# EAGLE design Main (EAGLE 7.2.0)
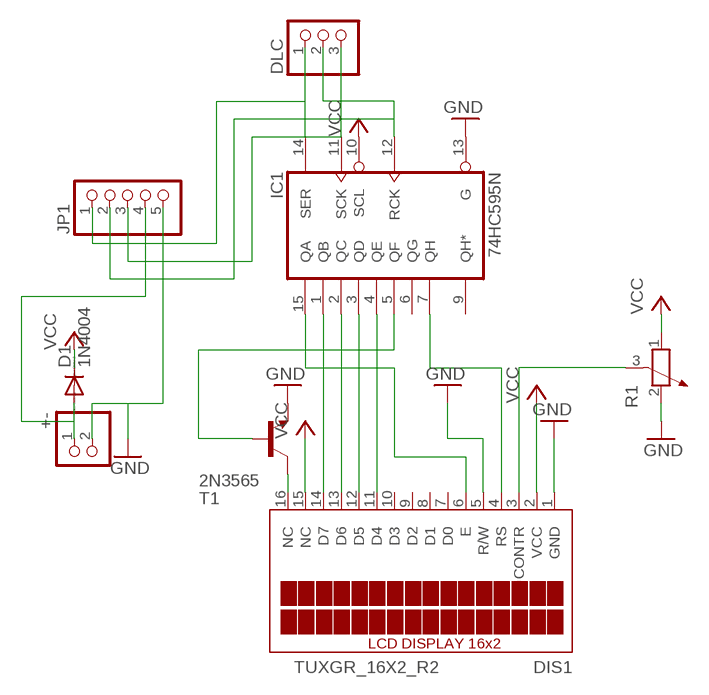
[diagram p0: schematic, sheet 1]

## Parts
+-  PINHD-1X2  [1X02]
D1  1N4004  [DO41-10]
DIS1  TUXGR_16X2_R2  [TUXGR_16X2_R2]
DLC  PINHD-1X3  [1X03]
IC1  74HC595N  [DIL16]
JP1  PINHD-1X5/90  [1X05/90]
R1  POTENTIOMETER_PT-10  [PT-10]
T1  2N3565  [TO92]

## Nets
GND: +-.2 DIS1.1(GND) DIS1.5(R/W) IC1.13(G) JP1.5 R1.2 T1.3(E)
N$1: DIS1.14(D7) IC1.1(QB)
N$2: DIS1.13(D6) IC1.2(QC)
N$3: DIS1.12(D5) IC1.3(QD)
N$4: DIS1.11(D4) IC1.4(QE)
N$5: +-.1 D1.A JP1.4
N$6: DIS1.16(NC) T1.1(C)
N$7: DIS1.6(E) IC1.15(QA)
N$8: DIS1.3(CONTR) R1.3
N$9: DIS1.4(RS) IC1.7(QH)
N$11: DLC.3 IC1.11(SCK) JP1.3
N$12: IC1.5(QF) T1.2(B)
N$13: DLC.1 IC1.14(SER) JP1.1
N$14: DLC.2 IC1.12(RCK) JP1.2
VCC: D1.C DIS1.2(VCC) DIS1.15(NC) IC1.10(SCL) R1.1
Unconnected: DIS1.7(D0) DIS1.8(D1) DIS1.9(D2) DIS1.10(D3) IC1.6(QG) IC1.9(QH*)

## Power pins joined to a net without a drawn wire
GND: IC1.8(GND)
VCC: IC1.16(VCC)

## Library data of the parts
+- = pinhead:PINHD-1X2: PIN HEADER
D1 = diode:1N4004: DIODE general purpose rectifier, 1 A
DIS1 = display-lcd:TUXGR_16X2_R2: Tuxgraphics LCD display 16x2 characters reflective, without background light Source: tuxgr_12x2_r2.pdf; OC_FARNELL: unknown; OC_NEWARK: unknown
DLC = pinhead:PINHD-1X3: PIN HEADER
IC1 = 74xx-eu:74*595: 8-bit SHIFT REGISTER, output latch
JP1 = pinhead:PINHD-1X5: PIN HEADER
R1 = rcl:POTENTIOMETER_: Potentiometer
T1 = transistor:2N3565: NPN TRANSISTOR

## Board
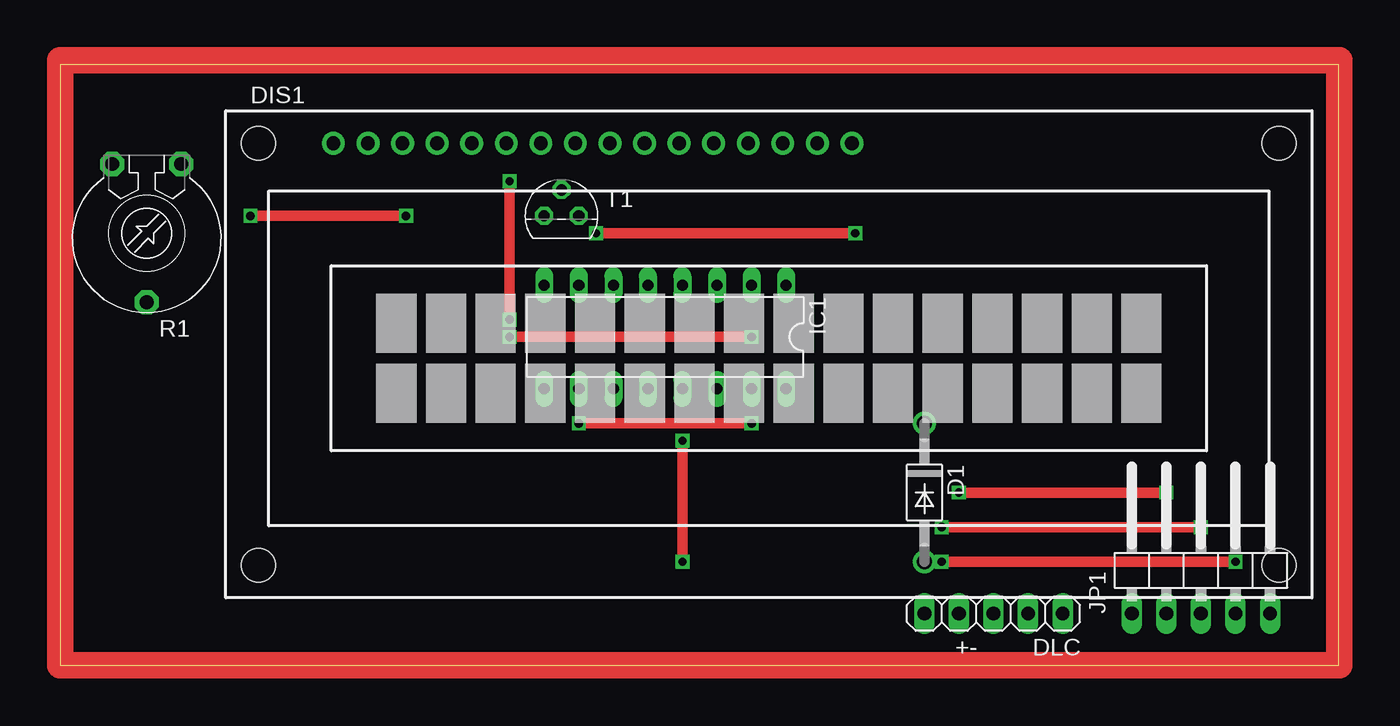
[diagram p1: board, top side]
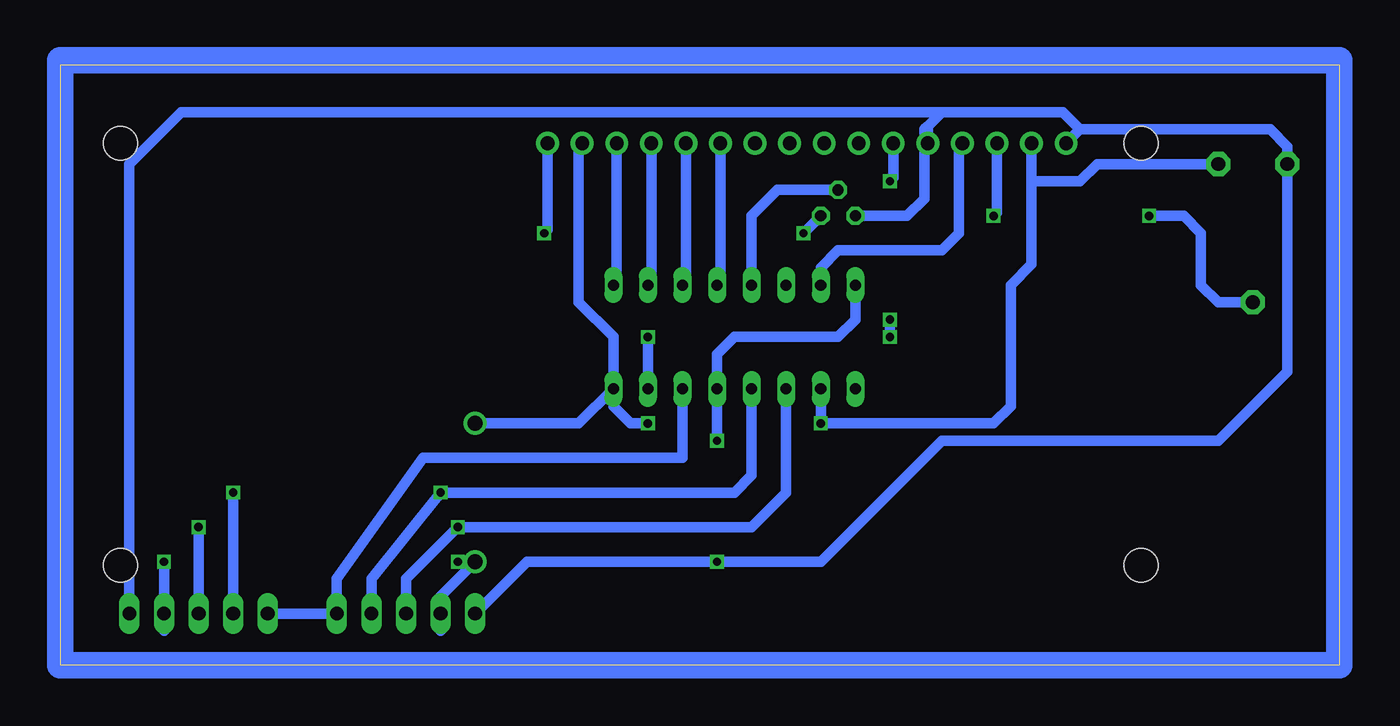
[diagram p2: board, bottom side, seen from below]

Size 93.96 x 44.12 mm. Coordinates in mm from the lower left corner, seen from the top.
Outline: 0,0 93.96,0 93.96,44.12 0,44.12 0,0
Copper layers (1*16): Top 0.035mm / dielectric 1.5mm / Bottom 0.035mm
Design rules "default *": minimum track width 30mil, minimum drill 24mil, track to track 8mil, track to pad 8mil, pad to pad 8mil, via to via 8mil, smd to smd 8mil, copper to edge 40mil, drill to drill 8mil, minimum pad ring 10mil, minimum via ring 8mil, stop-mask expansion 4mil, vias tented up to drill 0mil, thermal gap 10mil

### Footprints (pad centres in the part's own frame; a part is rotated, then mirrored left to right if it is on the bottom)
1X02 = drill 1.016 long: 1 -1.27,0; 2 1.27,0
DO41-10 = drill 1.118: A 5.08,0; C -5.08,0
TUXGR_16X2_R2 = drill 1 pad 1.676: 1 -32,15.5; 2 -29.46,15.5; 3 -26.92,15.5; 4 -24.38,15.5; 5 -21.84,15.5; 6 -19.3,15.5; 7 -16.76,15.5; 8 -14.22,15.5; 9 -11.68,15.5; 10 -9.14,15.5; 11 -6.6,15.5; 12 -4.06,15.5; 13 -1.52,15.5; 14 1.02,15.5; 15 3.56,15.5; 16 6.1,15.5 | hole 2.5: -37.5,-15.5; 37.5,-15.5; -37.5,15.5; 37.5,15.5
1X03 = drill 1.016 long: 1 -2.54,0; 2 0,0; 3 2.54,0
DIL16 = drill 0.813 long: 1 -8.89,-3.81; 2 -6.35,-3.81; 3 -3.81,-3.81; 4 -1.27,-3.81; 5 1.27,-3.81; 6 3.81,-3.81; 7 6.35,-3.81; 8 8.89,-3.81; 9 8.89,3.81; 10 6.35,3.81; 11 3.81,3.81; 12 1.27,3.81; 13 -1.27,3.81; 14 -3.81,3.81; 15 -6.35,3.81; 16 -8.89,3.81
1X05/90 = drill 1.016 long: 1 -5.08,-3.81; 2 -2.54,-3.81; 3 0,-3.81; 4 2.54,-3.81; 5 5.08,-3.81
PT-10 = drill 1.016 pad 1.778 octagon: 1 -2.54,-5.08; 2 2.54,-5.08; 3 0,5.08
TO92 = drill 0.813 octagon: 1 1.27,0; 2 0,1.905; 3 -1.27,0

### Placement (x,y rotation side)
+-  64.77,3.81 180 top
D1  63.5,12.7 270 top
DIS1  52.07,22.86 0 top
DLC  71.12,3.81 180 top
IC1  44.45,24.13 180 top
JP1  83.82,7.62 0 top
R1  6.35,31.75 180 top
T1  36.83,33.02 0 top

### Tracks (layer width: path | path; a pad name or v marks a point on that pad's centre or on a via)
GND  (via drill 0.61)
  Top 0.762: v45.72,16.51 v45.72,7.62
  Bottom 0.762: +-.2 59.69,7.62 v45.72,7.62 38.1,7.62 29.21,16.51 8.89,16.51 3.81,21.59 R1.2 3.81,38.1 5.08,39.37 19.05,39.37 | 19.05,39.37 19.06,39.37 | 19.06,39.37 DIS1.1 | 30.23,39.62 DIS1.5 30.48,38.11 | 30.23,39.62 29.21,40.64 | 20.32,40.64 20.32,40.63 19.06,39.37 | IC1.8 35.56,25.4 36.83,24.13 44.45,24.13 45.72,22.86 IC1.13 v45.72,16.51 | T1.3 31.75,33.02 30.48,34.29 30.48,38.11 | 30.48,38.11 30.48,39.37 30.23,39.62 | 29.21,40.64 20.32,40.64 | 20.32,40.64 19.05,39.37 | JP1.5 88.9,36.83 85.09,40.64 29.21,40.64
N$1
  Bottom 0.762: IC1.1 53.09,27.94 DIS1.14
N$2
  Bottom 0.762: IC1.2 50.55,27.94 DIS1.13
N$3
  Bottom 0.762: IC1.3 48.01,27.94 DIS1.12
N$4
  Bottom 0.762: IC1.4 45.47,27.94 DIS1.11
N$5  (via drill 0.61)
  Top 0.762: v86.36,7.62 v64.77,7.62
  Bottom 0.762: 86.36,2.54 JP1.4 v86.36,7.62 | 66.04,2.54 +-.1 66.04,5.08 D1.A v64.77,7.62
N$6  (via drill 0.61)
  Top 0.762: v58.42,31.75 v39.37,31.75
  Bottom 0.762: DIS1.16 58.17,32 v58.42,31.75 | v39.37,31.75 T1.1
N$7  (via drill 0.61)
  Top 0.762: v33.02,35.56 v33.02,25.4 | v33.02,24.13 v50.8,24.13
  Bottom 0.762: DIS1.6 32.77,35.81 v33.02,35.56 | v33.02,25.4 v33.02,24.13 | v50.8,24.13 IC1.15
N$8  (via drill 0.61)
  Top 0.762: v25.4,33.02 v13.97,33.02
  Bottom 0.762: DIS1.3 25.15,33.27 v25.4,33.02 | v13.97,33.02 11.43,33.02 10.16,31.75 10.16,27.94 8.89,26.67 R1.3
N$9
  Bottom 0.762: IC1.7 38.1,29.21 36.83,30.48 29.21,30.48 27.94,31.75 27.94,38.11 DIS1.4
N$10
  Bottom 1.93: 0,44.45 93.98,44.45 93.98,0 0,0 0,44.45
N$11  (via drill 0.61)
  Top 0.762: v83.82,10.16 v64.77,10.16
  Bottom 0.762: IC1.11 40.64,12.7 43.18,10.16 63.5,10.16 v64.77,10.16 68.58,6.35 DLC.3 | JP1.3 v83.82,10.16
N$12
  Bottom 0.762: T1.2 41.27,34.92 43.18,33.02 IC1.5
N$13
  Bottom 0.762: IC1.14 48.26,15.24 67.31,15.24 73.66,6.35 DLC.1 JP1.1
N$14  (via drill 0.61)
  Top 0.762: v81.28,12.7 v66.04,12.7
  Bottom 0.762: DLC.2 71.12,6.35 v66.04,12.7 64.77,12.7 44.45,12.7 43.18,13.97 IC1.12 | JP1.2 v81.28,12.7
N$15
  Top 1.93: 0,44.45 93.98,44.45 93.98,0 0,0 0,44.45
VCC  (via drill 0.61)
  Top 0.762: v38.1,17.78 v50.8,17.78
  Bottom 0.762: IC1.10 v38.1,17.78 25.4,17.78 24.13,19.05 24.13,27.94 22.61,29.46 22.61,35.56 | v50.8,17.78 52.07,17.78 53.34,19.05 IC1.16 | DIS1.2 22.61,35.56 | R1.1 17.78,36.83 19.05,35.56 22.61,35.56 | IC1.16 53.34,24.13 55.88,26.67 55.88,38.11 DIS1.15 | D1.C 55.88,17.78 IC1.16